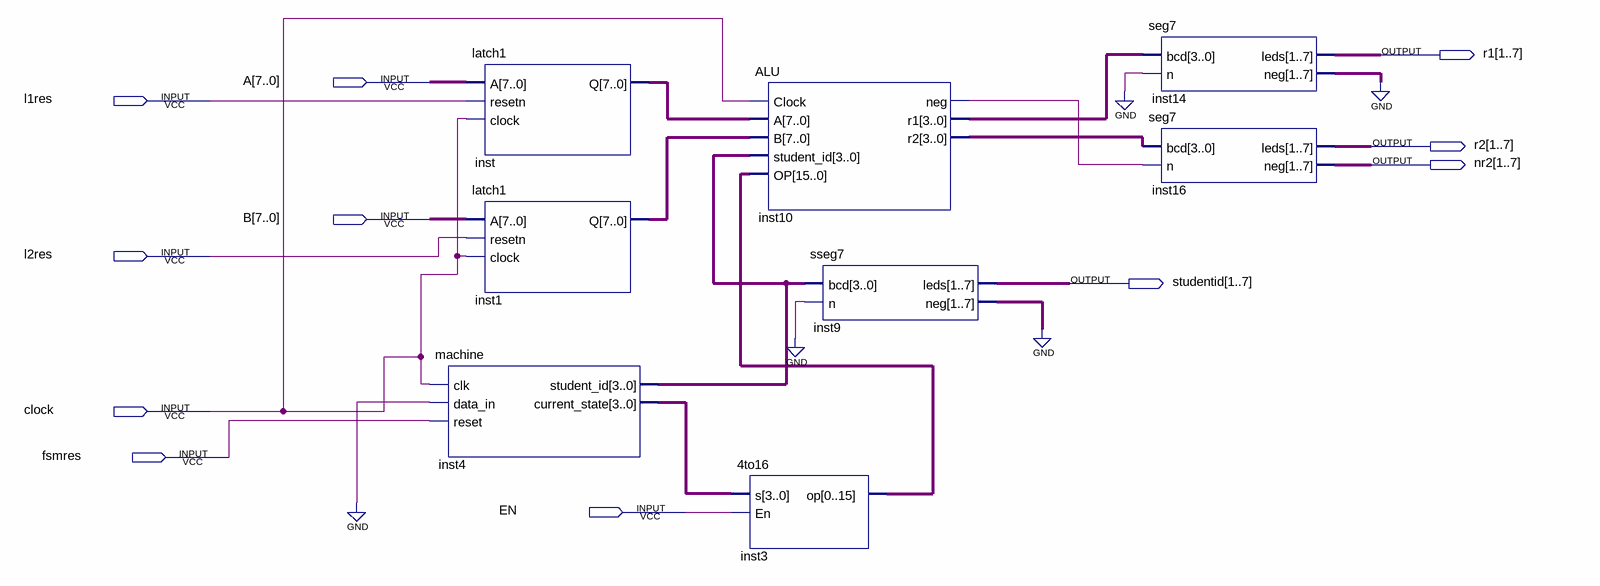
[diagram p0: schematic sheet]
// Quartus schematic gpul.bdf as structural Verilog: 8 symbols, 11 pins
module gpul (
  input  [7:0] A,
  input  l1res,
  input  [7:0] B,
  input  l2res,
  input  clock,
  input  fsmres,
  input  EN,
  output [1:7] r1,
  output [1:7] r2,
  output [1:7] nr2,
  output [1:7] studentid
);

  wire inst10_neg;
  wire [3:0] inst4_current_state, inst4_student_id, inst10_r1, inst10_r2;
  wire [6:0] inst9_neg, inst14_neg;
  wire [7:0] inst1_q, inst_q;
  wire [15:0] inst3_op;

  machine inst4 (
    .clk(clock), .data_in(1'b0), .reset(fsmres), .student_id(inst4_student_id),
    .current_state(inst4_current_state));
  latch1 inst (.A(A), .resetn(l1res), .clock(clock), .Q(inst_q));
  latch1 inst1 (.A(B), .resetn(l2res), .clock(clock), .Q(inst1_q));
  \4to16  inst3 (.s(inst4_current_state), .En(EN), .op(inst3_op));
  ALU inst10 (
    .Clock(clock), .A(inst_q), .B(inst1_q), .student_id(inst4_student_id), .OP(inst3_op), .neg(inst10_neg),
    .r1(inst10_r1), .r2(inst10_r2));
  sseg7 inst9 (.bcd(inst4_student_id), .n(1'b0), .leds(studentid), .neg(inst9_neg));
  seg7 inst14 (.bcd(inst10_r1), .n(1'b0), .leds(r1), .neg(inst14_neg));
  seg7 inst16 (.bcd(inst10_r2), .n(inst10_neg), .leds(r2), .neg(nr2));
  // also tied to GND on the sheet: {inst14_neg[0], inst14_neg[1], inst14_neg[2], inst14_neg[3], inst14_neg[4], inst14_neg[5], inst14_neg[6], inst9_neg[0], inst9_neg[1], inst9_neg[2], inst9_neg[3], inst9_neg[4], inst9_neg[5], inst9_neg[6]}
endmodule
